# Altium project Multi_protocols_v2.PrjPcb (part 1 of 2)
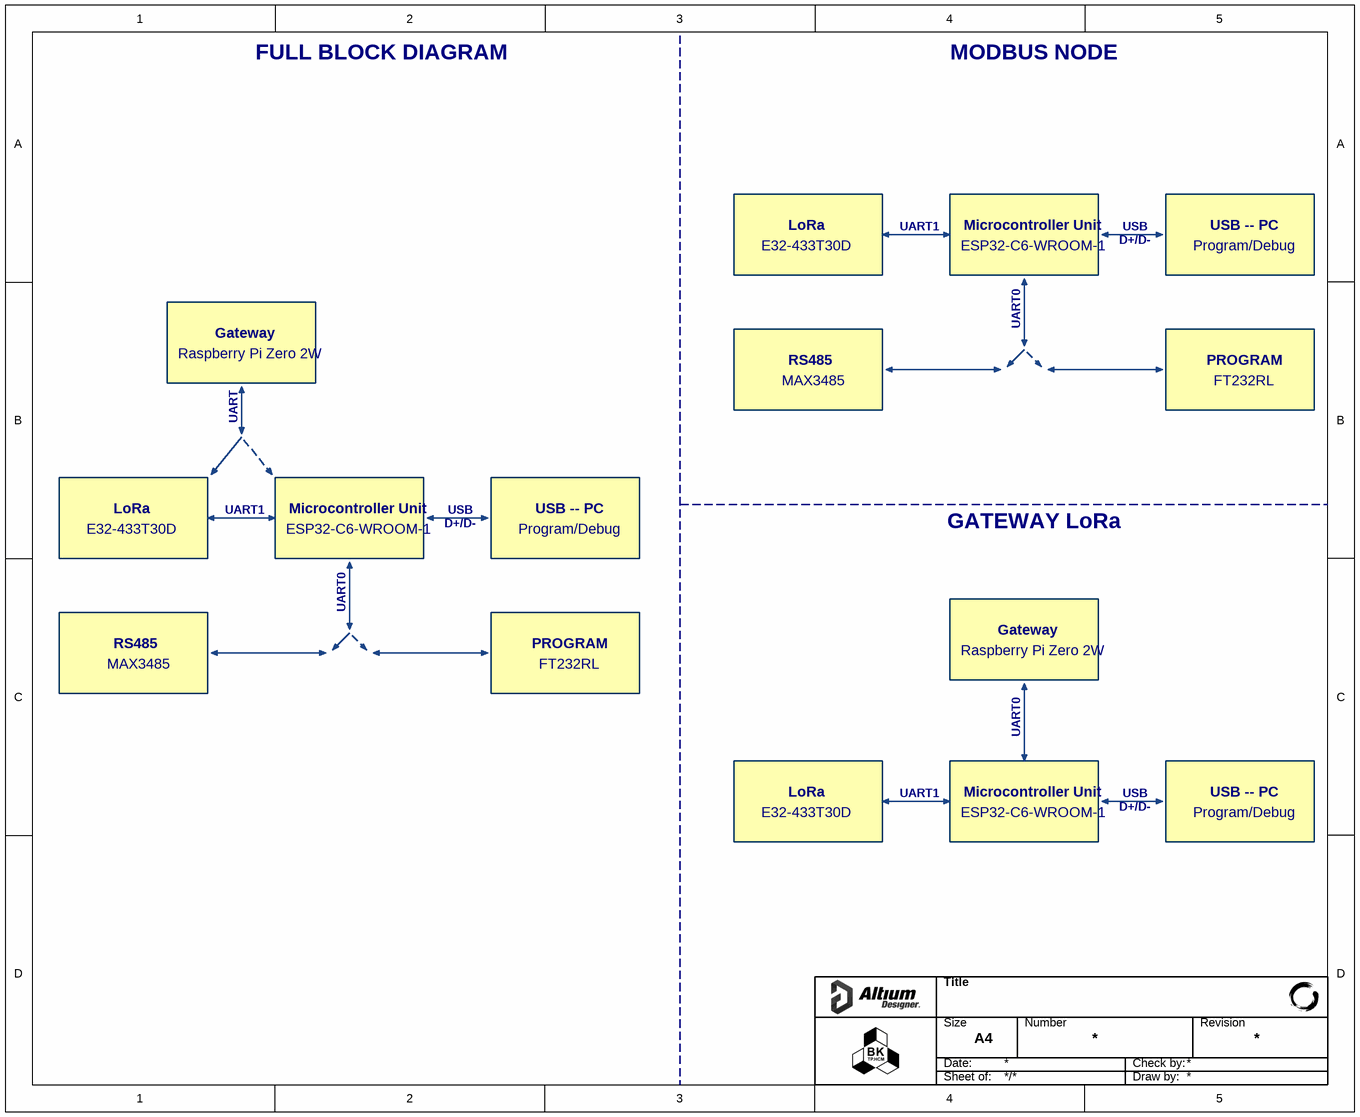
[diagram p0: [MP] Block diagram.SchDoc]
8 sheets, 137 parts. Net scope: global (net labels, ports and power ports of the same name join across sheets).
Board files: Mp_PCBv1.PcbDoc, MP_PCBv2.PcbDoc
Sheets:
  [MP] Block diagram.SchDoc
  [MP] MCU.SchDoc
  [MP] TTL UART USB.SchDoc
  [MP] LoRa.SchDoc
  [MP] RS485.SchDoc
  [MP] Power Diagram.SchDoc
  [MP] Power Circuit.SchDoc
  [MP] Relay Control.SchDoc

## Sheet [MP] Block diagram.SchDoc
size 254 x 208 mm

### Notes on the sheet
- FULL BLOCK DIAGRAM
- MODBUS NODE
- E32-433T30D
- LoRa
- UART1
- ESP32-C6-WROOM-1
- Microcontroller Unit
- D+/D-
- USB
- Program/Debug
- USB -- PC
- UART0
- Raspberry Pi Zero 2W
- Gateway
- MAX3485
- RS485
- PROGRAM
- FT232RL
- UART
- GATEWAY LoRa
- Title
- Size
- Date:
- A4
- Number
- Check by:
- Revision
- Sheet of:
- Draw by:

## Sheet [MP] MCU.SchDoc
size 254 x 208 mm; SheetNumber: 2; SheetTotal: 8
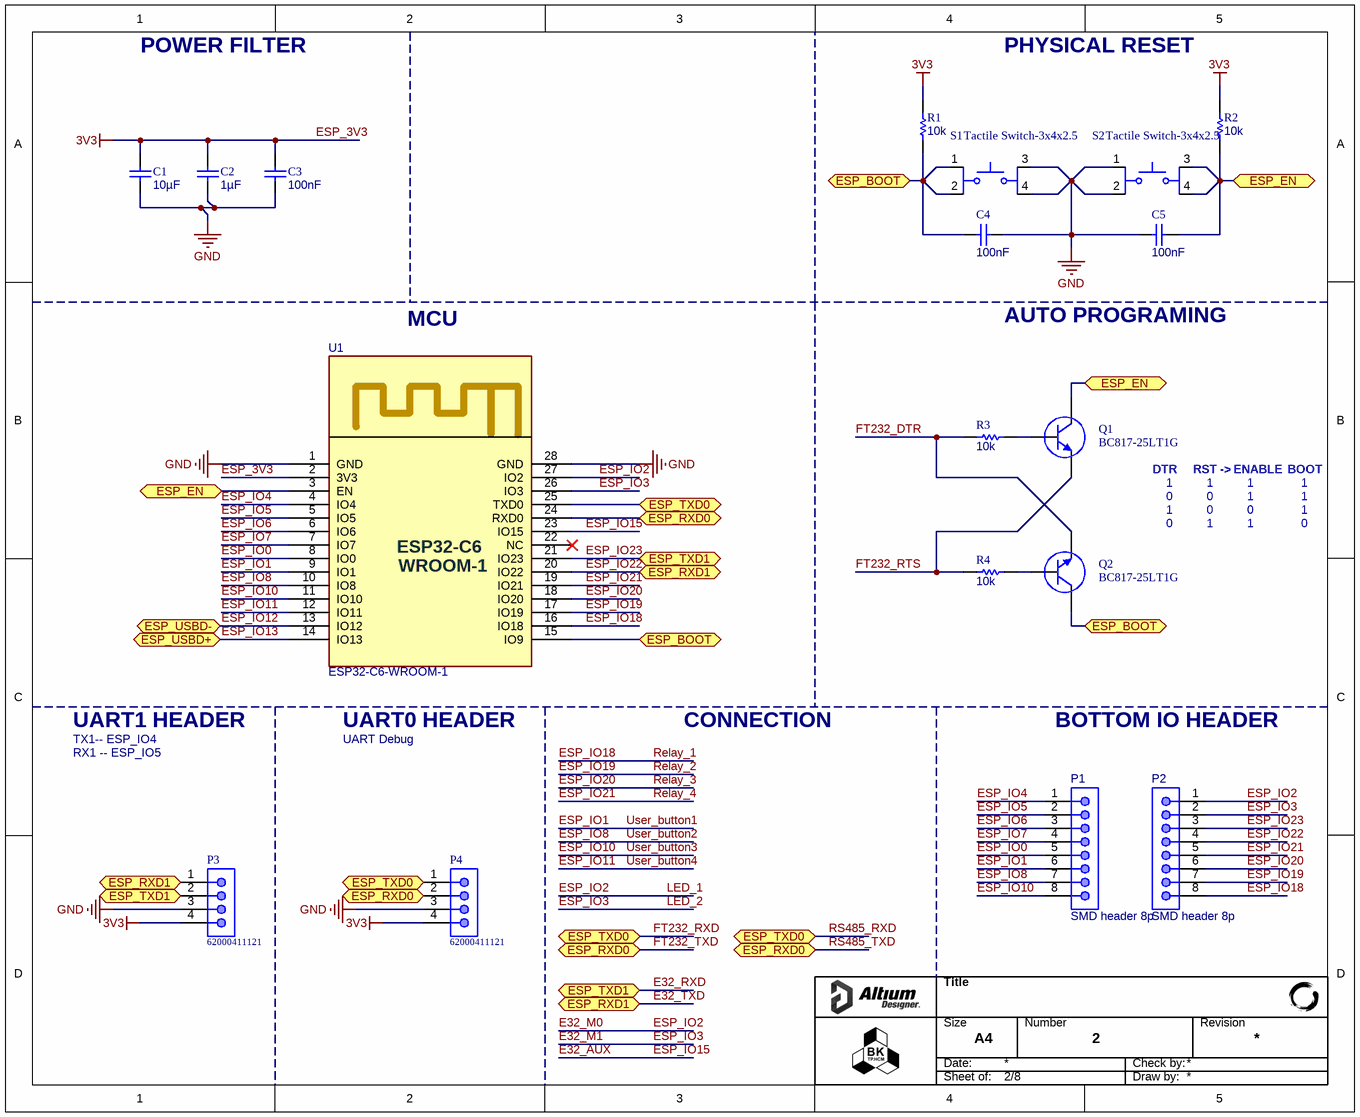
[diagram p1: [MP] MCU.SchDoc]

### Parts
C1  value 10µF  [CAP_0603]  (hidden comment: 0106031061010)
C2  value 1µF  [CAP_0603]  (hidden comment: 0106031051016)
C3  value 100nF  [CAP_0603]  (hidden comment: 0106031041050)
C4  value 100nF  [CAP_0603]  (hidden comment: 0106031041050)
C5  value 100nF  [CAP_0603]  (hidden comment: 0106031041050)
P1  SMD header 8p  [SMD header 8p]
P2  SMD header 8p  [SMD header 8p]
P3  62000411121  [62000411121]
P4  62000411121  [62000411121]
Q1  BC817-25LT1G  [ONSC-SOT-23-3-318-08_V]
Q2  BC817-25LT1G  [ONSC-SOT-23-3-318-08_V]
R1  value 10k  [RES_0603]  (hidden comment: 0006031031)
R2  value 10k  [RES_0603]  (hidden comment: 0006031031)
R3  value 10k  [RES_0603]  (hidden comment: 0006031031)
R4  value 10k  [RES_0603]  (hidden comment: 0006031031)
S1  Tactile Switch-3x4x2.5  [Tactile Switch-3x4x2.5 Footprint]
S2  Tactile Switch-3x4x2.5  [Tactile Switch-3x4x2.5 Footprint]
U1  ESP32-C6-WROOM-1  [ESP32-C6-WROOM-1-Footprint]

### Ports
ESP_BOOT (bidir), ESP_EN (bidir), ESP_RXD0 (bidir), ESP_RXD1 (bidir), ESP_TXD0 (bidir), ESP_TXD1 (bidir), ESP_USBD+ (bidir), ESP_USBD- (bidir)

### Nets
3V3: C1.2 C2.2 C3.2 P3.4 P4.4 R1.2 R2.2 U1.2(3V3)  [also labelled ESP_3V3]
GND: C1.1 C2.1 C3.1 C4.2 C5.1 P3.3 P4.3 S1.3 S1.4 S2.1 S2.2 U1.1(GND) U1.28(GND)
E32_AUX: U1.23(IO15)  [also labelled ESP_IO15]
E32_M0: P2.1 U1.27(IO2)  [also labelled ESP_IO2, LED_1]
E32_M1: P2.2 U1.26(IO3)  [also labelled ESP_IO3, LED_2]
E32_RXD: P2.3 P3.2 U1.21(IO23) ; port ESP_TXD1  [also labelled ESP_IO23]
E32_TXD: P2.4 P3.1 U1.20(IO22) ; port ESP_RXD1  [also labelled ESP_IO22]
ESP_BOOT: C4.1 Q2.3(C) R1.1 S1.1 S1.2 U1.15(IO9) ; port ESP_BOOT
ESP_EN: C5.2 Q1.3(C) R2.1 S2.3 S2.4 U1.3(EN) ; port ESP_EN
ESP_IO0: P1.5 U1.8(IO0)
ESP_IO1: P1.6 U1.9(IO1)  [also labelled User_button1]
ESP_IO4: P1.1 U1.4(IO4)
ESP_IO5: P1.2 U1.5(IO5)
ESP_IO6: P1.3 U1.6(IO6)
ESP_IO7: P1.4 U1.7(IO7)
ESP_IO8: P1.7 U1.10(IO8)  [also labelled User_button2]
ESP_IO10: P1.8 U1.11(IO10)  [also labelled User_button3]
ESP_IO11: U1.12(IO11)  [also labelled User_button4]
ESP_IO12: U1.13(IO12) ; port ESP_USBD-
ESP_IO13: U1.14(IO13) ; port ESP_USBD+
ESP_IO18: P2.8 U1.16(IO18)  [also labelled Relay_1]
ESP_IO19: P2.7 U1.17(IO19)  [also labelled Relay_2]
ESP_IO20: P2.6 U1.18(IO20)  [also labelled Relay_3]
ESP_IO21: P2.5 U1.19(IO21)  [also labelled Relay_4]
FT232_DTR: Q2.2(E) R3.2
FT232_RTS: Q1.2(E) R4.1
FT232_RXD: P4.1 U1.25(TXD0) ; port ESP_TXD0  [also labelled RS485_RXD]
FT232_TXD: P4.2 U1.24(RXD0) ; port ESP_RXD0  [also labelled RS485_TXD]
NetQ1_1: Q1.1(B) R3.1
NetQ2_1: Q2.1(B) R4.2

Not connected (* = marked no-connect by the designer): U1 22(NC)*

### Notes on the sheet
- POWER FILTER
- PHYSICAL RESET
- MCU
- AUTO PROGRAMING
- DTR
- 1
- 0
- RST
- ->
- ENABLE
- BOOT
- UART1 HEADER
- UART0 HEADER
- CONNECTION
- BOTTOM IO HEADER
- TX1-- ESP_IO4
- RX1 -- ESP_IO5
- UART Debug
- Title
- Size
- Date:
- A4
- Number
- Check by:
- Revision
- Sheet of:
- Draw by:
- (in symbol CMP-021-00010-2) ESP32-C6; WROOM-1

### Library data of the parts
C1 = CMP-001-00181-3: CAP, size 0603, 10 uF, 10 VDC, 10%; Manufacturer: Samsung Electro-Mechanics; Manufacturer Part Number: CL10A106KP8NNNC; Voltage Rating DC: 10 VDC; Supplier 2 Part Number: 1276-1192-2-ND; Pins: 2; Design Item ID: 0106031061010; Supplier 2 URL: https://www.digikey.com/en/products/detail/samsung-electro-mechanics/cl10a106kp8nnnc/3886850; Source: Capacitor_0603_10_percent.SchLib; Component Type: Standard; Operating Temperature Min: - 40 C; Packaging: Tape and Reel; Supplier 3 Part Number: N/A; Supplier 1 URL: https://www.mouser.vn/ProductDetail/Samsung-Electro-Mechanics/CL10A106KP8NNNC?qs=X6jEic%2FHinAlyfRHj7fKwg%3D%3D; LCSC Part #: C19702; Supplier 3 URL: https://www.thegioiic.com/tu-gom-0603-10uf-25v; ComponentLink1Description: Datasheet; Operating Temperature Max: + 85 C; ComponentLink1URL: https://www.mouser.vn/datasheet/2/585/MLCC-1837944.pdf; Mount: SMD/SMT; Case/Package: 0603; Supplier 1 Part Number: 187-CL10A106KP8NNNC; Tolerance: 10%
C2 = CMP-001-00177-3: CAP, size 0603, 1 uF, 16 VDC, 10%; Manufacturer Part Number: CL10B105KO8NNWC; Manufacturer: Samsung Electro-Mechanics; Voltage Rating DC: 16 VDC; Component Type: Standard; Supplier 3 URL: https://www.thegioiic.com/tu-gom-0603-1uf-16v; Operating Temperature Max: + 85 C; Tolerance: 10%; Supplier 3 Part Number: N/A; Source: Capacitor_0603_10_percent.SchLib; Case/Package: 0603; Supplier 1 Part Number: 187-CL10B105KO8NNWC; Operating Temperature Min: - 40 C; Packaging: Tape and Reel; Design Item ID: 0106031051016; LCSC Part #: C1592; Supplier 2 Part Number: 1276-CL10B105KO8NNWCTR-ND; Supplier 2 URL: https://www.digikey.com/en/products/detail/samsung-electro-mechanics/cl10b105ko8nnwc/16572783; Supplier 1 URL: https://www.mouser.vn/ProductDetail/Samsung-Electro-Mechanics/CL10B105KO8NNWC?qs=81r%252BiQLm7BT%252BXtc72qn1ug%3D%3D&utm_source=mouser-refine-download&utm_medium=file&utm_campaign=CL10B105KO8NNWC&utm_content=Samsung-Electro-Mechanics; ComponentLink1URL: https://www.mouser.vn/datasheet/2/585/Samsung_MLCC_1837944-1929650.pdf; Pins: 2; Mount: SMD/SMT; ComponentLink1Description: Datasheet
C3-C5 = CMP-001-00176-3: CAP, size 0603, 100 nF, 50 VDC, 10%; Manufacturer Part Number: CGA3E3X8R1H104K080AE; Manufacturer: TDK; Voltage Rating DC: 50 VDC; Source: Capacitor_0603_10_percent.SchLib; Operating Temperature Min: - 40 C; Supplier 3 URL: https://www.thegioiic.com/tu-gom-0603-100nf-0-1uf-50v; Supplier 1 Part Number: 810-CGA3E3X8R1H104KA; Mount: SMD/SMT; Supplier 1 URL: https://www.mouser.com/ProductDetail/TDK/CGA3E3X8R1H104K080AE?qs=nQSIdc08i%252Bd8g3IRRgU2bw%3D%3D&utm_source=mouser-refine-download&utm_medium=file&utm_campaign=CGA3E3X8R1H104K080AE&utm_content=TDK; Packaging: Tape and Reel; Supplier 3 Part Number: N/A; LCSC Part #: C14663; ComponentLink1Description: Datasheet; Operating Temperature Max: + 85 C; Design Item ID: 0106031041050; Supplier 2 URL: https://www.digikey.com/en/products/detail/tdk-corporation/cga3e3x8r1h104k080ae/5809262; Component Type: Standard; Supplier 2 Part Number: 445-173697-2-ND; Case/Package: 0603; Tolerance: 10%; ComponentLink1URL: https://product.tdk.com/system/files/dam/doc/product/capacitor/ceramic/mlcc/catalog/mlcc_automotive_soft_en.pdf?ref_disty=mouser; Pins: 2
P1 P2 = CMP-002-01370-2
P3 P4 = CMP-002-01189-1: WR-PHD Pin Header, THT, pitch 2mm, Single Row, Vertical, 4p; Manufacturer: Wurth Elektronik; Rated Current: 2A; Contact Resistance: 20mOhm; Working Voltage: 200VAC; Value: 2A, 200 V (AC); Withstanding Voltage: 500VAC; Pin Number: 4; Pins: 4; LCSC Part #: N/A; Orientation: Vertical; Supplier 3 URL: N/A; Supplier 3 Part Number: N/A; ComponentLink1URL: https://www.we-online.com/catalog/datasheet/62000411121.pdf; Source: WR-PHD_Pin Header_2.00mm.SchLib; Design Item ID: 62000411121; Operating Temperature Min: - 40 C; Row Number: Single; ComponentLink1Description: Datasheet; Component Type: Standard; Packaging: Bag; Supplier 2 Part Number: N/A; Supplier 1 Part Number: N/A; Operating Temperature Max: + 105 C; Manufacturer Part Number: 62000411121; Supplier 2 URL: N/A; Pitch: 2mm; Gender: Pin Header; Supplier 1 URL: N/A; Mount: THT
Q1 Q2 = CMP-013-00035-2: Small Signal Bipolar Transistor, 0.5A I(C), 45V V(BR)CEO, 1-Element, NPN, Silicon, TO-236; Frequency: 100MHz; Max Operating Temperature: 150°C; RoHS Compliant: Yes; Pins: 3
R1-R4 = CMP-009-00187-5: RES, size 0603, 10 KOhm, 1/10 W, 1%; Manufacturer Part Number: RC0603FR-0710KL; Manufacturer: YAGEO; Rated Power: 1/10 W; Source: Resistor_0603.SchLib; Pins: 2; Case/Package: 0603; Packaging: Tape and Reel; ComponentLink1Description: Datasheet; Component Type: Standard; Supplier 1 URL: N/A; Design Item ID: 0006031031; Supplier 2 Part Number: 311-10.0KHRTR-ND; Supplier 2 URL: https://www.digikey.com/en/products/detail/yageo/rc0603fr-0710kl/726880; Operating Temperature Max: + 85 C; Mount: SMD/SMT; Supplier 3 URL: N/A; Supplier 1 Part Number: N/A; Operating Temperature Min: - 40 C; LCSC Part #: C98220; Supplier 3 Part Number: N/A; ComponentLink1URL: https://fscdn.rohm.com/en/products/databook/datasheet/passive/resistor/chip_resistor/esr-e.pdf; Tolerance: 1%
S1 S2 = CMP-011-00013-6: Tactile Switch, 3x4x2.5mm; Pins: 4; Mounting Technology: SMT
U1 = CMP-021-00010-2: Module that supports 2.4 GHz Wi-Fi 6 (802.11ax), Bluetooth® 5 (LE), Zigbee and

## Sheet [MP] TTL UART USB.SchDoc
size 254 x 208 mm; SheetNumber: 3; SheetTotal: 8
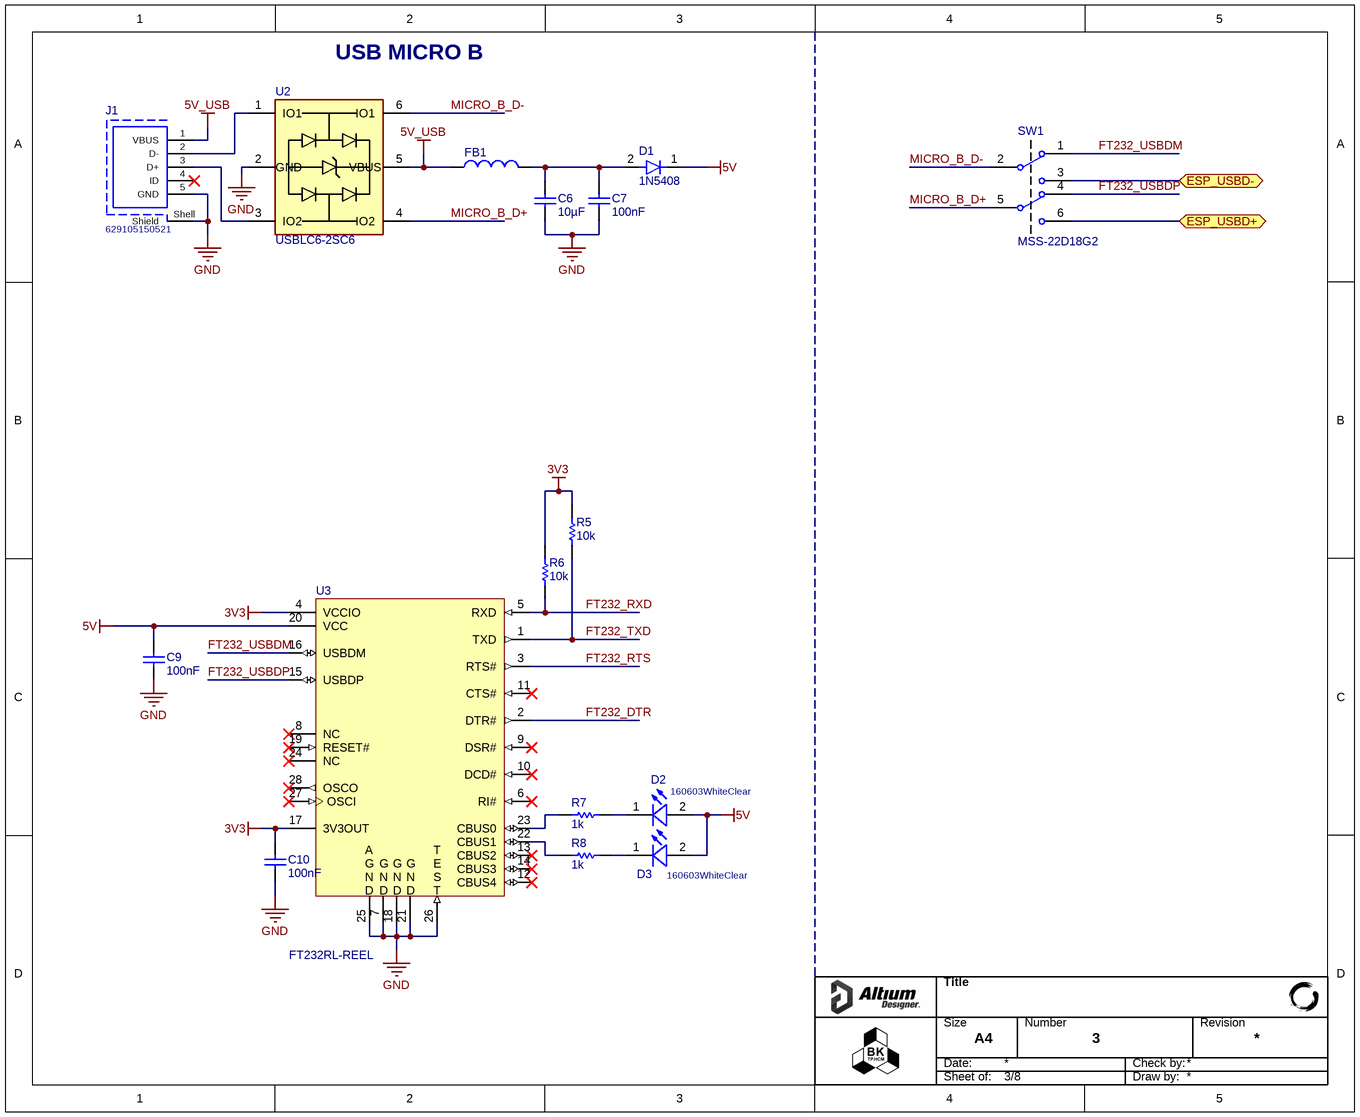
[diagram p2: [MP] TTL UART USB.SchDoc]

### Parts
C6  value 10µF  [CAP_0603]  (hidden comment: 0106031061010)
C7  value 100nF  [CAP_0603]  (hidden comment: 0106031041050)
C9  value 100nF  [CAP_0603]  (hidden comment: 0106031041050)
C10  value 100nF  [CAP_0603]  (hidden comment: 0106031041050)
D1  1N5408  [FAIR-SMA-2_B_V]
D2  160603WhiteClear  [WL-SMCW_0603_H=0.7mm]
D3  160603WhiteClear  [WL-SMCW_0603_H=0.7mm]
FB1  CBG160808U601T  [CBG160808U601T-Footprint]  (value not drawn)
J1  629105150521  [629105150521]
R5  value 10k  [RES_0603]  (hidden comment: 0006031031)
R6  value 10k  [RES_0603]  (hidden comment: 0006031031)
R7  value 1k  [RES_0603]  (hidden comment: 0006031021)
R8  value 1k  [RES_0603]  (hidden comment: 0006031021)
SW1  MSS-22D18G2  [MSS-22D18G2]
U2  USBLC6-2SC6  [USBLC6-2SC6-Footprint-1]
U3  FT232RL-REEL  [FTDI-SSOP-28_L]

### Ports
ESP_USBD+ (bidir), ESP_USBD- (bidir)

### Nets
3V3: C10.2 R5.2 R6.2 U3.4(VCCIO) U3.17(3V3OUT)
5V: C9.2 D1.1(K) D2.2(A) D3.2(A) U3.20(VCC)
5V_USB: FB1.1 J1.1(VBUS) U2.5(VBUS)
GND: C6.1 C7.2 C9.1 C10.1 J1.5(GND) J1.Shell(Shield) U2.2(GND) U3.7(GND) U3.18(GND) U3.21(GND) U3.25(AGND) U3.26(TEST)
ESP_IO12: SW1.3(1-2) ; port ESP_USBD-
ESP_IO13: SW1.6(2-2) ; port ESP_USBD+
FT232_DTR: U3.2(DTR#)
FT232_RTS: U3.3(RTS#)
FT232_RXD: R6.1 U3.5(RXD)
FT232_TXD: R5.1 U3.1(TXD)
FT232_USBDM: SW1.1(1-1) U3.16(USBDM)
FT232_USBDP: SW1.4(2-1) U3.15(USBDP)
MICRO_B_D+: SW1.5(COM2) U2.4(IO2)
MICRO_B_D-: SW1.2(COM1) U2.6(IO1)
NetC6_2: C6.2 C7.1 D1.2(A) FB1.2
NetD2_1: D2.1(K) R7.1
NetD3_1: D3.1(K) R8.1
NetJ1_2: J1.2(D-) U2.1(IO1)
NetJ1_3: J1.3(D+) U2.3(IO2)
NetR7_2: R7.2 U3.23(CBUS0)
NetR8_2: R8.2 U3.22(CBUS1)

Not connected (* = marked no-connect by the designer): J1 4(ID)*; U3 6(RI#)* 8(NC)* 9(DSR#)* 10(DCD#)* 11(CTS#)* 12(CBUS4)* 13(CBUS2)* 14(CBUS3)* 19(RESET#)* 24(NC)* 27(OSCI)* 28(OSCO)*

### Notes on the sheet
- (near U2) USB MICRO B
- Title
- Size
- Date:
- A4
- Number
- Check by:
- Revision
- Sheet of:
- Draw by:
- (in symbol CMP-015-00000-6) A / G / N / D; G / N / D; T / E / S / T

### Library data of the parts
C6 = CMP-001-00181-3: as C1 on sheet [MP] MCU; Supplier 2 Part Number: 1276-1192-2-ND; Pins: 2; Design Item ID: 0106031061010; Supplier 2 URL: https://www.digikey.com/en/products/detail/samsung-electro-mechanics/cl10a106kp8nnnc/3886850; Source: Capacitor_0603_10_percent.SchLib; Component Type: Standard; Operating Temperature Min: - 40 C; Packaging: Tape and Reel; Supplier 3 Part Number: N/A; Supplier 1 URL: https://www.mouser.vn/ProductDetail/Samsung-Electro-Mechanics/CL10A106KP8NNNC?qs=X6jEic%2FHinAlyfRHj7fKwg%3D%3D; LCSC Part #: C19702; Supplier 3 URL: https://www.thegioiic.com/tu-gom-0603-10uf-25v; ComponentLink1Description: Datasheet; Operating Temperature Max: + 85 C; ComponentLink1URL: https://www.mouser.vn/datasheet/2/585/MLCC-1837944.pdf; Mount: SMD/SMT; Case/Package: 0603; Supplier 1 Part Number: 187-CL10A106KP8NNNC; Tolerance: 10%
C7 C9 C10 = CMP-001-00176-3: as C3 on sheet [MP] MCU; Source: Capacitor_0603_10_percent.SchLib; Operating Temperature Min: - 40 C; Supplier 3 URL: https://www.thegioiic.com/tu-gom-0603-100nf-0-1uf-50v; Supplier 1 Part Number: 810-CGA3E3X8R1H104KA; Mount: SMD/SMT; Supplier 1 URL: https://www.mouser.com/ProductDetail/TDK/CGA3E3X8R1H104K080AE?qs=nQSIdc08i%252Bd8g3IRRgU2bw%3D%3D&utm_source=mouser-refine-download&utm_medium=file&utm_campaign=CGA3E3X8R1H104K080AE&utm_content=TDK; Packaging: Tape and Reel; Supplier 3 Part Number: N/A; LCSC Part #: C14663; ComponentLink1Description: Datasheet; Operating Temperature Max: + 85 C; Design Item ID: 0106031041050; Supplier 2 URL: https://www.digikey.com/en/products/detail/tdk-corporation/cga3e3x8r1h104k080ae/5809262; Component Type: Standard; Supplier 2 Part Number: 445-173697-2-ND; Case/Package: 0603; Tolerance: 10%; ComponentLink1URL: https://product.tdk.com/system/files/dam/doc/product/capacitor/ceramic/mlcc/catalog/mlcc_automotive_soft_en.pdf?ref_disty=mouser; Pins: 2
D1 = CMP-004-00058-1: Rectifier Diode, Schottky, 1 Phase, 1 Element, 3A, 1KV, Silicon; Forward Voltage: 475mV; Pins: 2; RoHS Compliant: Yes; Max Operating Temperature: 125°C
D2 D3 = CMP-004-00040-2: WL-SMCW SMT Mono-color Chip LED Waterclear, size 0603, White; Type: Clear; ComponentLink2Description: Supplier 1 URL; Supplier 1 Name: Mouser; ComponentLink3URL: https://www.digikey.com/en/products/detail/inolux/IN-S63AT5UW/7604931; Supplier 3 URL: https://www.thegioiic.com/led-trang-0603-dan-smd-trong-suot; ComponentLink1URL: N/A; Source: WL-SMCW_0603.SchLib; Component Type: Standard; ComponentLink1Description: Datasheet link; Supplier 2 Name: Digi-Key; ComponentLink3Description: Supplier 2 URL; Pins: 2; ComponentLink4Description: Supplier 3 URL; ComponentLink2URL: https://www.mouser.vn/ProductDetail/ROHM-Semiconductor/SMLA12WBN7W1?qs=TCDPyi3sCW1efPV6dhaUAA%3D%3D; Supplier 2 SN: 1830-1063-2-ND; Supplier 2 URL: https://www.digikey.com/en/products/detail/inolux/IN-S63AT5UW/7604931; Supplier 3 Name: ICDayRoi; Size: 0603; Design Item ID: 160603WhiteClear; Supplier 1 SN: 755-SMLA12WBN7W1; Color: White; Supplier 3 SN: N/A; ComponentLink4URL: https://www.thegioiic.com/led-trang-0603-dan-smd-trong-suot; Supplier 1 URL: https://www.mouser.vn/ProductDetail/ROHM-Semiconductor/SMLA12WBN7W1?qs=TCDPyi3sCW1efPV6dhaUAA%3D%3D; Value: White
FB1 = CMP-006-00022-1: 0603 600Ω ±25% DCR=0.5Ω 0.2A
J1 = CMP-002-00305-5: Micro USB 2.0 Type B Receptacle WR-COM, Horizontal, SMT, with Pegs, High Current at Pin 1 & Pin 5
R5 R6 = CMP-009-00187-5: as R1 on sheet [MP] MCU; Source: Resistor_0603.SchLib; Pins: 2; Case/Package: 0603; Packaging: Tape and Reel; ComponentLink1Description: Datasheet; Component Type: Standard; Supplier 1 URL: N/A; Design Item ID: 0006031031; Supplier 2 Part Number: 311-10.0KHRTR-ND; Supplier 2 URL: https://www.digikey.com/en/products/detail/yageo/rc0603fr-0710kl/726880; Operating Temperature Max: + 85 C; Mount: SMD/SMT; Supplier 3 URL: N/A; Supplier 1 Part Number: N/A; Operating Temperature Min: - 40 C; LCSC Part #: C98220; Supplier 3 Part Number: N/A; ComponentLink1URL: https://fscdn.rohm.com/en/products/databook/datasheet/passive/resistor/chip_resistor/esr-e.pdf; Tolerance: 1%
R7 R8 = CMP-009-00185-5: RES, size 0603, 1 KOhm, 1/10 W, 1%; Manufacturer Part Number: RC0603FR-071KL; Manufacturer: YAGEO; Rated Power: 1/10 W; Tolerance: 1%; Supplier 1 URL: https://www.mouser.vn/ProductDetail/YAGEO/RC0603FR-071KL?qs=VU8sRB4EgwApHsk4rF%2F3zg%3D%3D; ComponentLink1URL: https://www.yageo.com/upload/media/product/productsearch/datasheet/rchip/PYu-SR_20105_RoHS_L_10.pdf; Supplier 3 URL: N/A; Case/Package: 0603; Supplier 2 URL: https://www.digikey.com/en/products/detail/yageo/rc0603fr-071kl/726843; Mount: SMD/SMT; Supplier 2 Part Number: 311-1.00KHRTR-ND; Source: Resistor_0603.SchLib; Packaging: Tape and Reel; Component Type: Standard; Design Item ID: 0006031021; ComponentLink1Description: Datasheet; Operating Temperature Max: + 85 C; Supplier 3 Part Number: N/A; Operating Temperature Min: - 40 C; LCSC Part #: C22548; Supplier 1 Part Number: 603-RC0603FR-071KL; Pins: 2
SW1 = CMP-011-00019-3: Slide switch 2.5
U2 = CMP-004-00055-2: 17V Clamp 5A (8/20Âµs) Ipp Tvs Diode Surface Mount SOT-23-6
U3 = CMP-015-00000-6: USB UART IC, -0.5 to 6 V, 24 mA, -40 to 85 degC, 28-Pin SSOP, RoHS, Tape and Reel; Manufacturer: Future Technology Devices International (FTDI); Nominal Supply Voltage: 5V; Max Supply Voltage: 5.25V; Min Supply Voltage: 3.3V; Channels: 1; Data Rate: 3Mbps; Max Operating Temperature: 85°C; Pins: 16; Locally Supplier URL: https://www.thegioiic.com/ft232rl-ic-usb-to-serial-uart-28-ssop; RoHS Compliant: True; Packaging: TapeandReel; Min Operating Temperature: -40°C; Interface: UART; Datasheet Version: Rev. 1.04, 02/2006; Locally Supplier Name: Thegioiic; Case/Package: SSOP; Manufacturer URL: http://www.ftdichip.com/; Package Quantity: 2000; Datasheet URL: http://datasheet.octopart.com/FT232RL-FTDI-datasheet-120501.pdf

## Sheet [MP] LoRa.SchDoc
size 254 x 208 mm; SheetNumber: 4; SheetTotal: 8
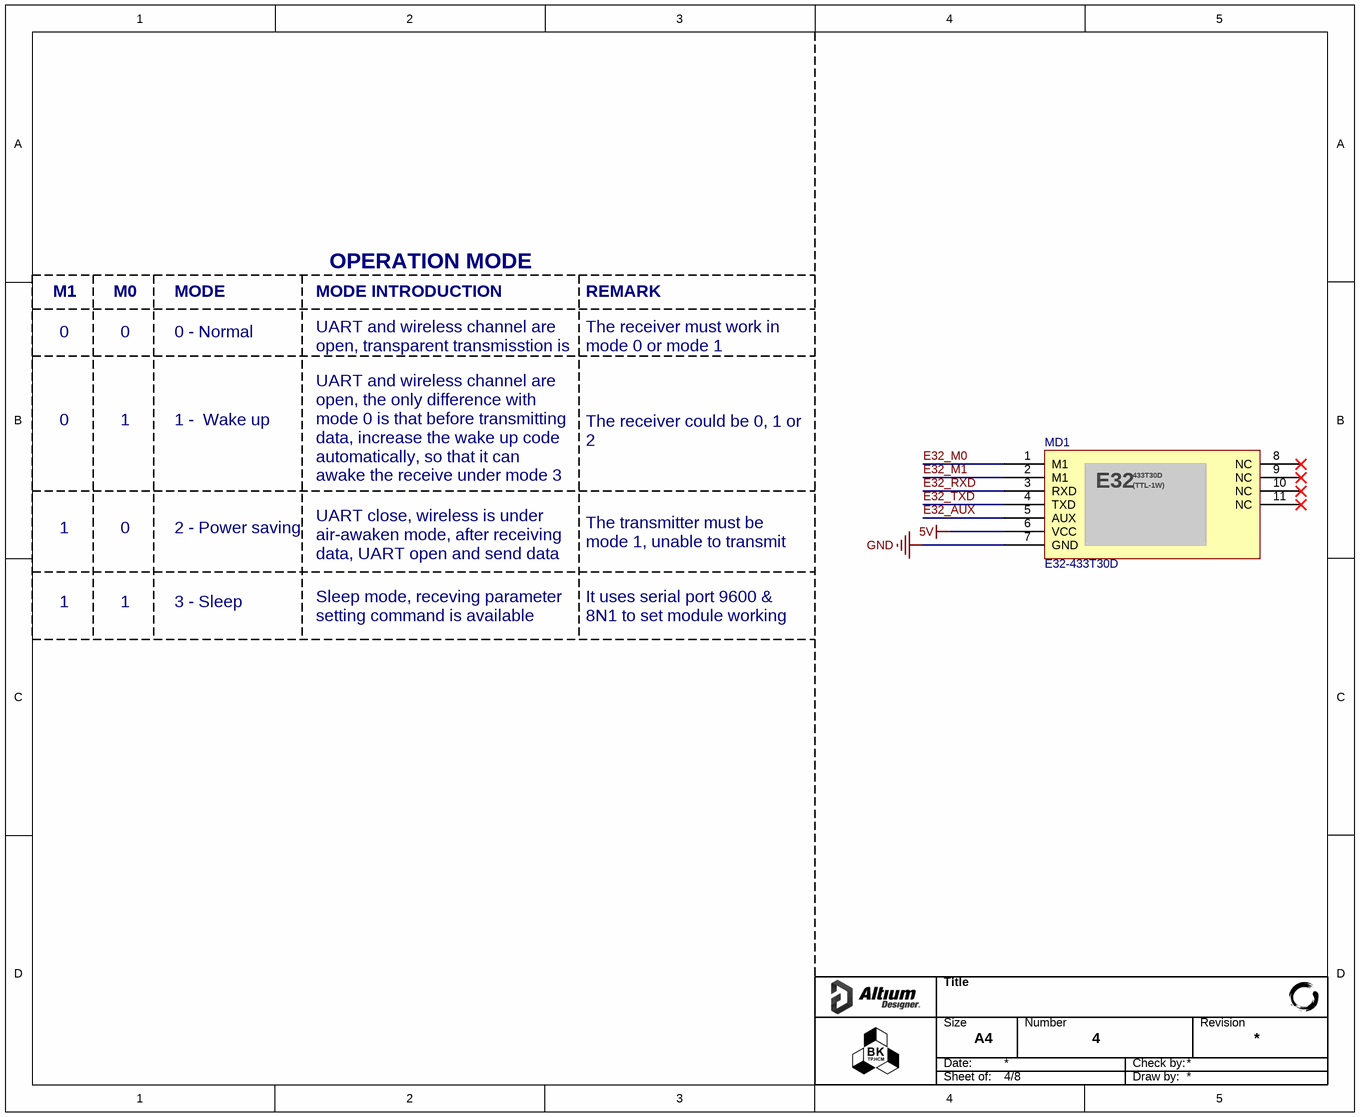
[diagram p3: [MP] LoRa.SchDoc]

### Parts
MD1  E32-433T30D  [E32-433T30D]

### Nets
5V: MD1.6(VCC)
GND: MD1.7(GND)
E32_AUX: MD1.5(AUX)
E32_M0: MD1.1(M1)
E32_M1: MD1.2(M1)
E32_RXD: MD1.3(RXD)
E32_TXD: MD1.4(TXD)

Not connected (* = marked no-connect by the designer): MD1 8(NC)* 9(NC)* 10(NC)* 11(NC)*

### Notes on the sheet
- M1
- M0
- MODE
- MODE INTRODUCTION
- OPERATION MODE
- REMARK
- 0
- 0 - Normal
- UART and wireless channel are open, transparent transmisstion is on
- The receiver must work in mode 0 or mode 1
- 1
- 1 -  Wake up
- The receiver could be 0, 1 or 2
- UART and wireless channel are open, the only difference with mode 0 is that before transmitting data, increase the wake up code automatically, so that it can awake the receive under mode 3
- 2 - Power saving
- The transmitter must be mode 1, unable to transmit in this mode
- 3 - Sleep
- UART close, wireless is under air-awaken mode, after receiving data, UART open and send data
- It uses serial port 9600 & 8N1 to set module working parameters
- Sleep mode, receving parameter setting command is available
- Title
- Size
- Date:
- A4
- Number
- Check by:
- Revision
- Sheet of:
- Draw by:
- (in symbol CMP-021-00011-2) 433T30D; E32; (TTL-1W)

### Library data of the parts
MD1 = CMP-021-00011-2

## Sheet [MP] RS485.SchDoc
size 254 x 208 mm; SheetNumber: 5; SheetTotal: 8
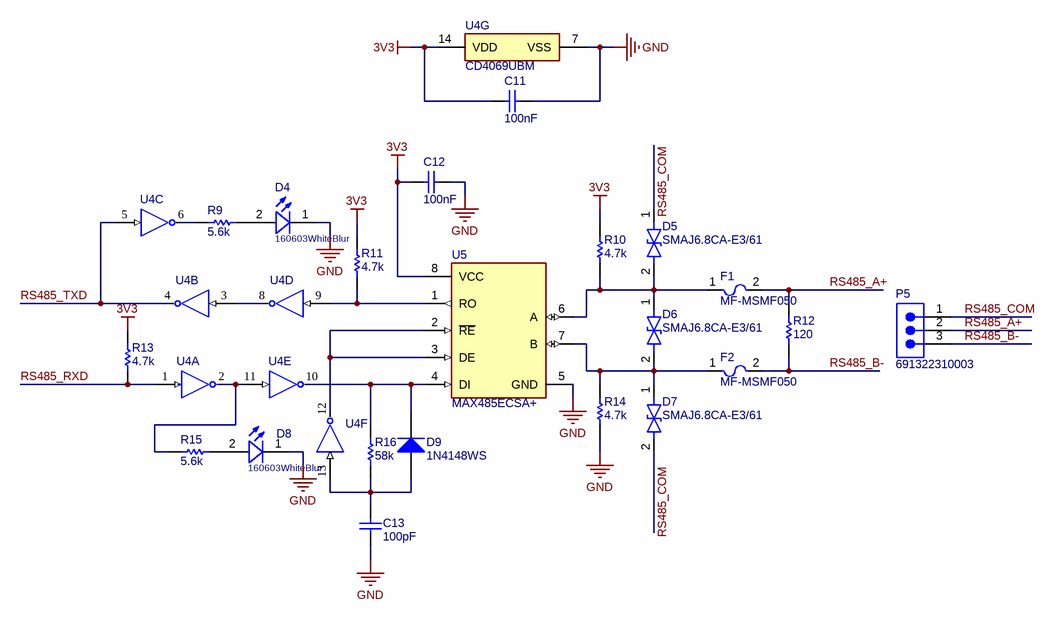
[diagram p4: [MP] RS485.SchDoc]

### Parts
C11  value 100nF  [CAP_0603]  (hidden comment: 0106031041050)
C12  value 100nF  [CAP_0603]  (hidden comment: 0106031041050)
C13  value 100pF  [CAP_0603]  (hidden comment: 0106031010550)
D4  160603WhiteBlur  [WL-SMCW_0603_H=0.7mm]
D5  SMAJ6.8CA-E3/61  [VISH-DO-214AC-2_M]
D6  SMAJ6.8CA-E3/61  [VISH-DO-214AC-2_M]
D7  SMAJ6.8CA-E3/61  [VISH-DO-214AC-2_M]
D8  160603WhiteBlur  [WL-SMCW_0603_H=0.7mm]
D9  1N4148WS  [FAIR-SOD-323_V]
F1  MF-MSMF050  [BOUR-MF-MSMF050-2_V]
F2  MF-MSMF050  [BOUR-MF-MSMF050-2_V]
P5  691322310003  [691322310003]
R9  value 5.6k  [RES_0603]  (hidden comment: 0006035621)
R10  value 4.7k  [RES_0603]  (hidden comment: 0006034721)
R11  value 4.7k  [RES_0603]  (hidden comment: 0006034721)
R12  value 120  [RES_0603]  (hidden comment: 0006031215)
R13  value 4.7k  [RES_0603]  (hidden comment: 0006034721)
R14  value 4.7k  [RES_0603]  (hidden comment: 0006034721)
R15  value 5.6k  [RES_0603]  (hidden comment: 0006035621)
R16  value 58k  [RES_0603]  (hidden comment: 0006035835)
U4  CD4069UBM  [FP-D0014A-MFG]  (value not drawn)  (parts A,B,C,D,E,F,G of 7)
U5  MAX485ECSA+  [FP-S8-5-MFG]

### Nets
3V3: C11.2 C12.2 R10.1 R11.1 R13.1 U4.14(VDD) U5.8(VCC)
GND: C11.1 C12.1 C13.1 D4.1(K) D8.1(K) R14.2 U4.7(VSS) U5.5(GND)
RS485_A+: F1.2 P5.2 R12.2
RS485_B-: F2.2 P5.3 R12.1
RS485_COM: D5.1(K) D7.2(A) P5.1
RS485_RXD: R13.2 U4.1(A)  [project net FT232_RXD]
RS485_TXD: U4.4(~{B}) U4.5(C)  [project net FT232_TXD]
NetC13_2: C13.2 D9.1(A) R16.1 U4.13(F)
NetD4_2: D4.2(A) R9.2
NetD5_2: D5.2(A) D6.1(K) F1.1 R10.2 U5.6(A)
NetD6_2: D6.2(A) D7.1(K) F2.1 R14.1 U5.7(B)
NetD8_2: D8.2(A) R15.2
NetD9_2: D9.2(K) R16.2 U4.10(~{E}) U5.4(DI)
NetR9_1: R9.1 U4.6(~{C})
NetR11_2: R11.2 U4.9(D) U5.1(RO)
NetR15_1: R15.1 U4.2(~{A}) U4.11(E)
NetU4_3: U4.3(B) U4.8(~{D})
NetU4_12: U4.12(~{F}) U5.2(~{RE}) U5.3(DE)

### Notes on the sheet
- Title
- Size
- Date:
- A4
- Number
- Check by:
- Revision
- Sheet of:
- Draw by:

### Library data of the parts
C11 C12 = CMP-001-00176-3: as C3 on sheet [MP] MCU; Source: Capacitor_0603_10_percent.SchLib; Operating Temperature Min: - 40 C; Supplier 3 URL: https://www.thegioiic.com/tu-gom-0603-100nf-0-1uf-50v; Supplier 1 Part Number: 810-CGA3E3X8R1H104KA; Mount: SMD/SMT; Supplier 1 URL: https://www.mouser.com/ProductDetail/TDK/CGA3E3X8R1H104K080AE?qs=nQSIdc08i%252Bd8g3IRRgU2bw%3D%3D&utm_source=mouser-refine-download&utm_medium=file&utm_campaign=CGA3E3X8R1H104K080AE&utm_content=TDK; Packaging: Tape and Reel; Supplier 3 Part Number: N/A; LCSC Part #: C14663; ComponentLink1Description: Datasheet; Operating Temperature Max: + 85 C; Design Item ID: 0106031041050; Supplier 2 URL: https://www.digikey.com/en/products/detail/tdk-corporation/cga3e3x8r1h104k080ae/5809262; Component Type: Standard; Supplier 2 Part Number: 445-173697-2-ND; Case/Package: 0603; Tolerance: 10%; ComponentLink1URL: https://product.tdk.com/system/files/dam/doc/product/capacitor/ceramic/mlcc/catalog/mlcc_automotive_soft_en.pdf?ref_disty=mouser; Pins: 2
C13 = CMP-001-00171-3: CAP, size 0603, 100 pF, 50 VDC, 5%; Manufacturer: TDK; Manufacturer Part Number: CGA3E2C0G1H101J080AA; Voltage Rating DC: 50 VDC; Operating Temperature Min: - 40 C; Supplier 1 Part Number: 810-CGA3E2C0G1H101J; Design Item ID: 0106031010550; Component Type: Standard; Mount: SMD/SMT; Supplier 2 Part Number: 445-5640-2-ND; ComponentLink1URL: https://product.tdk.com/system/files/dam/doc/product/capacitor/ceramic/mlcc/catalog/mlcc_automotive_general_en.pdf?ref_disty=mouser; Operating Temperature Max: + 85 C; Packaging: Tape and Reel; Case/Package: 0603; Supplier 3 Part Number: N/A; Supplier 1 URL: https://www.mouser.com/ProductDetail/TDK/CGA3E2C0G1H101J080AA?qs=FxQuwy19cyBF0gUakpLdHA%3D%3D&utm_source=mouser-refine-download&utm_medium=file&utm_campaign=CGA3E2C0G1H101J080AA&utm_content=TDK; Supplier 2 URL: https://www.digikey.com/en/products/detail/tdk-corporation/cga3e2c0g1h101j080aa/2443118; LCSC Part #: N/A; Source: Capacitor_0603_5_percent.SchLib; Tolerance: 5%; Pins: 2; Supplier 3 URL: N/A; ComponentLink1Description: Datasheet
D4 D8 = CMP-004-00039-2: WL-SMCW SMT Mono-color Chip LED Blur, size 0603, White; ComponentLink4URL: N/A; ComponentLink3Description: Supplier 2 URL; Pins: 2; ComponentLink2Description: Supplier 1 URL; ComponentLink2URL: https://www.mouser.vn/ProductDetail/ROHM-Semiconductor/SMLEN3WBC8W1?qs=W0yvOO0ixfGun78rr9Unsw%3D%3D; Supplier 3 URL: N/A; Design Item ID: 160603WhiteBlur; Type: Blur; Supplier 1 SN: 755-SMLEN3WBC8W1; Supplier 3 Name: ICDayRoi; Supplier 2 SN: 1516-1057-2-ND; Color: White; Supplier 1 Name: Mouser; ComponentLink1Description: Datasheet link; Component Type: Standard; ComponentLink4Description: Supplier 3 URL; Supplier 1 URL: https://www.mouser.vn/ProductDetail/ROHM-Semiconductor/SMLEN3WBC8W1?qs=W0yvOO0ixfGun78rr9Unsw%3D%3D; Supplier 2 Name: Digi-Key; ComponentLink1URL: N/A; ComponentLink3URL: https://www.digikey.com/en/products/detail/qt-brightek-qtb/QBLP601-IW/4814655; Supplier 2 URL: https://www.digikey.com/en/products/detail/qt-brightek-qtb/QBLP601-IW/4814655; Value: White; Source: WL-SMCW_0603.SchLib; Size: 0603; Supplier 3 SN: N/A
D5-D7 = CMP-004-00057-2: Trans Voltage Suppressor Diode, 400W, 6V V(RWM), Bidirectional, 1 Element, Silicon, DO-214AC; RoHS Compliant: Yes; Min Operating Temperature: -55°C; Pins: 2; Max Operating Temperature: 150°C
D9 = CMP-004-00001-3: Small Signal Diode, 75 V, 0.15 A, -55 to 150 degC, 2-Pin SOD-323, RoHS, Tape and Reel; Manufacturer: Fairchild; Peak Reverse Current: 5uA; Recovery Time: 4ns; Forward Voltage: 1V; Forward Current: 150mA; Capacitance: -323f; Package Description: 2-Pin Small Outline Diode Flat Lead, Body 1.7 x 1.25 mm; Datasheet URL: https://www.fairchildsemi.com/datasheets/1N/1N4148WS.pdf; Manufacturer URL: https://www.fairchildsemi.com/; Datasheet Version: Rev. 1.2, 03/2015; Package Reference: SOD-323; Max Operating Temperature: 150°C; Case/Package: SOD-323; Mounting Technology: SM; Package Quantity: 3000; Min Operating Temperature: -55°C; Pins: 2; Packaging: TapeandReel; RoHS Compliant: True
F1 F2 = CMP-005-00000-5: PTC Resettable Fuse, 15 V, 500 mA, -40 to 85 degC, 2-Pin SMD, RoHS, Tape and Reel; Manufacturer: Bourns; Current Rating: 100A; Package Description: 2-Pin Surface Mount Device, Body 4.55 x 3.24 mm; Max Operating Temperature: 85°C; Min Operating Temperature: -40°C; RoHS Compliant: False; Datasheet Version: Rev. AG, 08/2016; Datasheet URL: http://www.bourns.com/data/global/pdfs/mfmsmf.pdf; Packaging: TapeandReel; Mounting Technology: SM; Case/Package: MF-MSMF050-2; Package Reference: MF-MSMF050-2
P5 = CMP-002-00338-1: WR-TBL Series 322 Horizontal PCB Header, THT, pitch 3.81mm, 3p; Manufacturer: Wurth Elektronik; Modularity: No; Working Voltage: 300V; Rated Current: 10A; Value: 10A, 300V; Supplier 3 Part Number: N/A; Mount: Through Hole; Operating Temperature Max: 105°C; Operating Temperature Min: -40°C; Category: Terminal Blocks; Supplier 1 URL: N/A; Design Item ID: 691322310003; ComponentLink1URL: https://www.we-online.com/redexpert/spec/691322310003?ad; Number of Rows: 1; Supplier 3 URL: https://www.thegioiic.com/ul-3-81-3-r-terminal-block-plug-in-han-pcb-3-chan-cong-3-81mm-300v-10a-ulo; Component Type: Standard; Manufacturer Part Number: 691322310003; Orientation: Horizontal; Pin Count: 3; Pitch: 3.81mm; Source: Terminal_Blocks_Pluggable_3.81mm.SchLib; ComponentLink1Description: Datasheet; Supplier 2 URL: N/A; Supplier 1 Part Number: N/A; Supplier 2 Part Number: N/A; Pins: 3; Packaging: Box; Match Code: WR-TBL; Application: Pluggable
R9 R15 = CMP-009-00362-5: RES, size 0603, 5.6 KOhm, 1/10 W, 1%; Manufacturer Part Number: OEM; Rated Power: 1/10 W; Operating Temperature Max: + 85 C; Tolerance: 1%; Component Type: Standard; Source: Resistor_0603.SchLib; Design Item ID: 0006035621; Supplier 3 Part Number: N/A; Packaging: Tape and Reel; Supplier 1 Part Number: 667-ERJ-UP3F5601V; Manufacturer: OEM; Operating Temperature Min: - 40 C; Pins: 2; Supplier 3 URL: N/A; Supplier 1 URL: https://www.mouser.vn/ProductDetail/Panasonic/ERJ-UP3F5601V?qs=sGAEpiMZZMvdGkrng054twq3eZrCFN89ezYxgAsnxBTZYD17cS%252B65A%3D%3D; Supplier 2 Part Number: 10-ERJ-UP3F5601VTR-ND 10-ERJ-UP3F5601VCT-ND 10-ERJ-UP3F5601VDKR-ND; ComponentLink1Description: Datasheet; ComponentLink1URL: https://api.pim.na.industrial.panasonic.com/file_stream/main/fileversion/4484; Case/Package: 0603; LCSC Part #: N/A; Supplier 2 URL: https://www.digikey.com/en/products/detail/panasonic-electronic-components/ERJ-UP3F5601V/12092890; Mount: SMD/SMT
R10 R11 R13 R14 = CMP-009-00346-5: RES, size 0603, 4.7 kOhm, 1/10 W, 1%; Manufacturer Part Number: RC0603FR-074K7L; Manufacturer: YAGEO; Rated Power: 1/10 W; Design Item ID: 0006034721; Supplier 1 URL: https://www.mouser.vn/ProductDetail/YAGEO/RC0603FR-074K7L?qs=gt6vzsuosg37y0l7Vt36bQ%3D%3D; Source: Resistor_0603.SchLib; Supplier 2 URL: N/A; LCSC Part #: C99782; Supplier 2 Part Number: N/A; Supplier 1 Part Number: 603-RC0603FR-074K7L; Pins: 2; Packaging: Tape and Reel; ComponentLink1URL: https://www.mouser.vn/datasheet/2/447/YAGEO_PYu_RC_Group_51_RoHS_L_12-3313492.pdf; Supplier 3 Part Number: N/A; Component Type: Standard; Operating Temperature Max: + 85 C; Supplier 3 URL: N/A; Operating Temperature Min: - 40 C; Case/Package: 0603; ComponentLink1Description: Datasheet; Tolerance: 1%; Mount: SMD/SMT
R12 = CMP-009-00207-5: RES, size 0603, 120 Ohm, 1/10 W, 5%; Manufacturer Part Number: ERJ-PA3J121V; Manufacturer: Panasonic; Rated Power: 1/10 W; Supplier 1 Part Number: 667-ERJ-PA3J121V; Supplier 2 Part Number: P120BZTR-ND - Tape & Reel (TR); Operating Temperature Min: - 40 C; Supplier 2 URL: https://www.digikey.com/en/products/detail/panasonic-electronic-components/ERJ-PA3J121V/5035980?s=N4IgTCBcDaIGxwOwFoCiAlAUsgCgQQGZMBGMYgNRAF0BfIA; Source: Resistor_0603.SchLib; ComponentLink1Description: Datasheet; Packaging: Tape and Reel; Operating Temperature Max: + 85 C; Case/Package: 0603; Mount: SMD/SMT; Tolerance: 5%; Supplier 3 URL: https://www.thegioiic.com/dien-tro-120-ohm-0603-5; Pins: 2; Component Type: Standard; Supplier 3 Part Number: N/A; Design Item ID: 0006031215; Supplier 1 URL: https://www.mouser.vn/ProductDetail/Panasonic/ERJ-PA3J121V?qs=BzJM0faLVqUskHAfNBlRjA%3D%3D; ComponentLink1URL: https://www.mouser.vn/datasheet/2/315/AOA0000C331-1141874.pdf; LCSC Part #: N/A
R16 = CMP-009-00365-5: RES, size 0603, 58 KOhm, 1/10 W, 5%; Manufacturer: OEM; Rated Power: 1/10 W; Supplier 1 Part Number: N/A; Case/Package: 0603; Mount: SMD/SMT; Supplier 3 Part Number: N/A; ComponentLink1Description: Datasheet; Packaging: Tape and Reel; LCSC Part #: N/A; Supplier 3 URL: N/A; Source: Resistor_0603.SchLib; ComponentLink1URL: N/A; Supplier 1 URL: N/A; Pins: 2; Design Item ID: 0006035835; Supplier 2 URL: N/A; Component Type: Standard; Supplier 2 Part Number: N/A; Operating Temperature Max: + 85 C; Manufacturer Part Number: OEM; Operating Temperature Min: - 40 C; Tolerance: 5%
U4 = CMP-016-00018-2: Inverter, 4000/14000/40000 Series, 6-Func, 1-Input, CMOS, PDSO14; Max Supply Voltage: 18V; Min Supply Voltage: 3V; Nominal Supply Voltage: 5V; RoHS Compliant: Yes; Pins: 14; Min Operating Temperature: -55°C; Case/Package: SOP; Logic Type: INVERTER; Max Operating Temperature: 125°C
U5 = CMP-015-00010-1: Line Transceiver, 1 Func, 1 Driver, 1 Rcvr, CMOS, PDSO8; Nominal Supply Voltage: 5V; Min Supply Voltage: 4.75V; Max Supply Voltage: 5.25V; Pins: 8; Case/Package: SOP; Min Operating Temperature: 0°C; Max Operating Temperature: 70°C; RoHS Compliant: Yes

## Sheet [MP] Power Diagram.SchDoc
size 254 x 208 mm; SheetNumber: 6; SheetTotal: 8
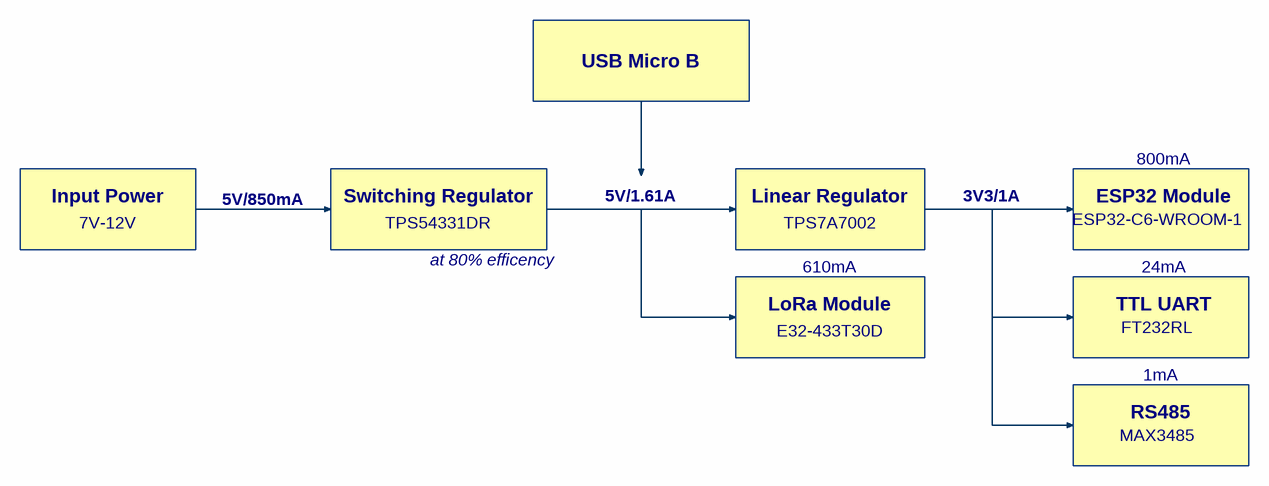
[diagram p5: [MP] Power Diagram.SchDoc]

### Notes on the sheet
- USB Micro B
- Input Power
- 5V/850mA
- Switching Regulator
- 5V/1.61A
- Linear Regulator
- 3V3/1A
- ESP32 Module
- 800mA
- 7V-12V
- TPS54331DR
- at 80% efficency
- TPS7A7002
- 610mA
- ESP32-C6-WROOM-1
- 24mA
- LoRa Module
- E32-433T30D
- FT232RL
- TTL UART
- 1mA
- MAX3485
- RS485
- Title
- Size
- Date:
- A4
- Number
- Check by:
- Revision
- Sheet of:
- Draw by: